# EAGLE schematic kugarem (EAGLE 7.6.0)
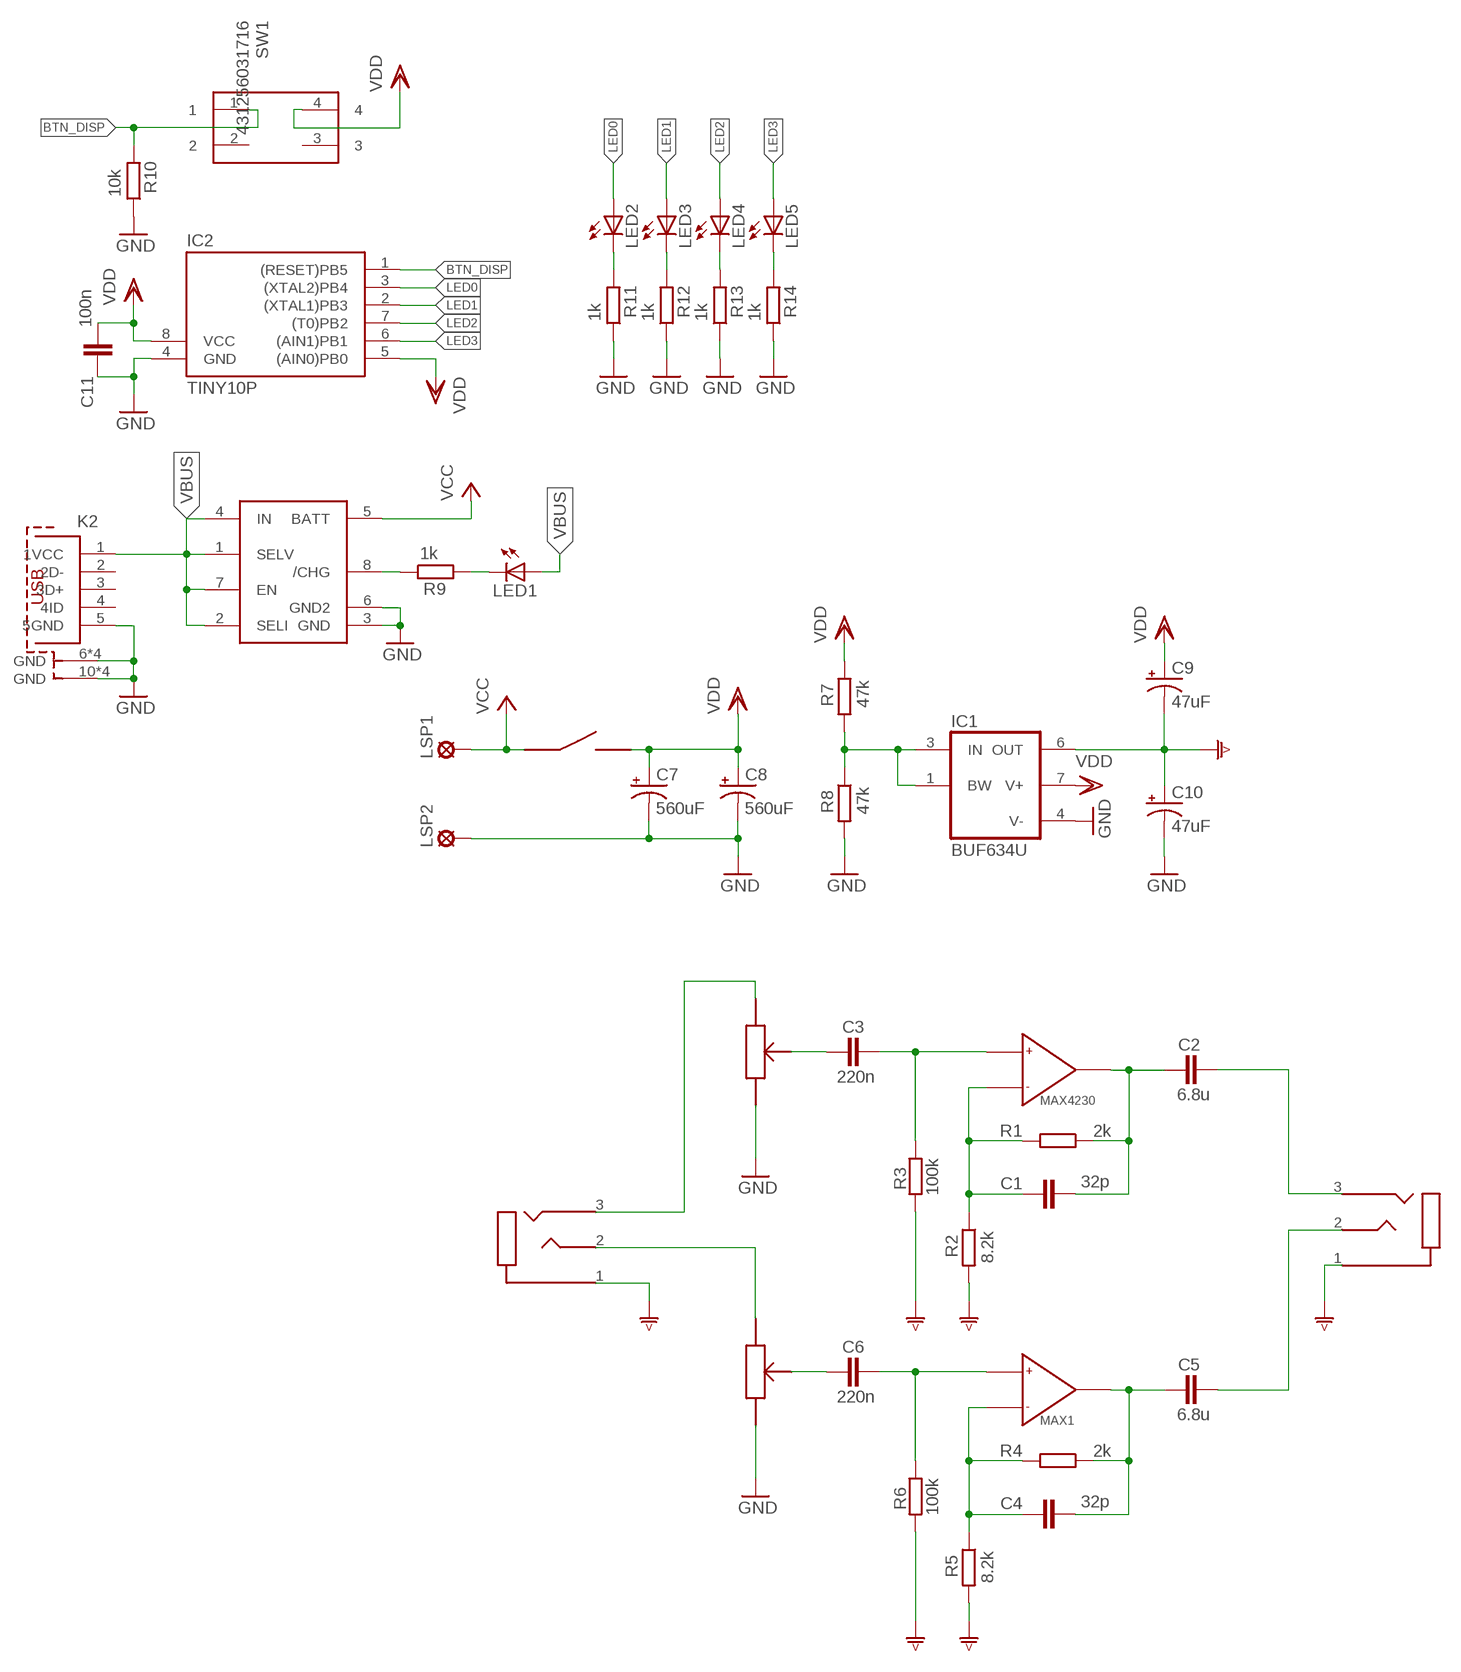
[diagram p0: schematic, sheet 1]

## Parts
C1  32p  C-EUC1206  [C1206]
C2  6.8u  C-EUC1206  [C1206]
C3  220n  C-EUC1206  [C1206]
C4  32p  C-EUC1206  [C1206]
C5  6.8u  C-EUC1206  [C1206]
C6  220n  C-EUC1206  [C1206]
C7  560uF  560UF-PANASONIC_G-25V-20%  [PANASONIC_G]
C8  560uF  560UF-PANASONIC_G-25V-20%  [PANASONIC_G]
C9  47uF  47UF-POLAR-PANASONIC_D-35V-20%  [PANASONIC_D]
C10  47uF  47UF-POLAR-PANASONIC_D-35V-20%  [PANASONIC_D]
C11  100n  C-EUC1206  [C1206]
IC1  BUF634U  [SO08]
IC2  TINY10P  [DIL08]
K2  629105150921  [629105150921]
LED1  LEDCHIPLED_1206  [CHIPLED_1206]
LED2  LEDCHIPLED_1206  [CHIPLED_1206]
LED3  LEDCHIPLED_1206  [CHIPLED_1206]
LED4  LEDCHIPLED_1206  [CHIPLED_1206]
LED5  LEDCHIPLED_1206  [CHIPLED_1206]
LSP1  LSP10  [LSP10]
LSP2  LSP10  [LSP10]
MAX1  MAX4230  [SOT23-5L]
MAX4230  MAX4230  [SOT23-5L]
R1  2k  R-EU_R1206  [R1206]
R2  8.2k  R-EU_R1206  [R1206]
R3  100k  R-EU_R1206  [R1206]
R4  2k  R-EU_R1206  [R1206]
R5  8.2k  R-EU_R1206  [R1206]
R6  100k  R-EU_R1206  [R1206]
R7  47k  R-EU_R1206  [R1206]
R8  47k  R-EU_R1206  [R1206]
R9  1k  R-EU_R1206  [R1206]
R10  10k  R-EU_R1206  [R1206]
R11  1k  R-EU_R1206  [R1206]
R12  1k  R-EU_R1206  [R1206]
R13  1k  R-EU_R1206  [R1206]
R14  1k  R-EU_R1206  [R1206]
SW1  431256031716  [431256031716]
U$1  100k  PTR90  [PTR902]
U$2  SJ1-3515-SMT-TR  [STX-35332-3N-TR]
U$3  SJ1-3515-SMT-TR  [STX-35332-3N-TR]
U$4  MAX1811SO8  [SO08]

## Nets
BTN_DISP: IC2.1((RESET)PB5) R10.2 SW1.1
GND: C7.- C8.- C10.- C11.1 IC1.4(V-) IC2.4(GND) K2.5(5GND) K2.6(GND) K2.7(GND) K2.8(GND) K2.9(GND) K2.10(GND) K2.11(GND) K2.12(GND) K2.13(GND) LSP2.MP R8.2 R10.1 R11.1 R12.1 R13.1 R14.1 U$1.R13 U$1.R23 U$4.3(GND) U$4.6(GND2)
LED0: IC2.3((XTAL2)PB4) LED2.A
LED1: IC2.2((XTAL1)PB3) LED3.A
LED2: IC2.7((T0)PB2) LED4.A
LED3: IC2.6((AIN1)PB1) LED5.A
N$1: C1.2 C2.1 MAX4230.4(OUT) R1.1
N$2: C1.1 MAX4230.3(IN-) R1.2 R2.1
N$3: C2.2 U$3.3(RING)
N$4: C3.2 MAX4230.1(IN+) R3.1
N$5: C4.2 C5.1 MAX1.4(OUT) R4.1
N$6: C4.1 MAX1.3(IN-) R4.2 R5.1
N$7: C3.1 U$1.R22
N$8: C6.2 MAX1.1(IN+) R6.1
N$9: C5.2 U$3.2(TIP)
N$10: C6.1 U$1.R12
N$11: U$1.R21 U$2.3(RING)
N$12: U$1.R11 U$2.2(TIP)
N$13: LED2.C R11.2
N$14: LED3.C R12.2
N$15: LED1.C R9.2
N$16: R9.1 U$4.8(/CHG)
N$17: IC1.1(BW) IC1.3(IN) R7.2 R8.1
N$18: LED4.C R13.2
N$19: LED5.C R14.2
VBUS: K2.1(1VCC) LED1.A U$4.1(SELV) U$4.2(SELI) U$4.4(IN) U$4.7(EN)
VCC: LSP1.MP U$1.SW1 U$4.5(BATT)
VDD: C7.+ C8.+ C9.+ C11.2 IC1.7(V+) IC2.5((AIN0)PB0) IC2.8(VCC) R7.1 SW1.4 U$1.SW2
VGND: C9.- C10.+ IC1.6(OUT) R2.2 R3.2 R5.2 R6.2 U$2.1(SLEEVE) U$3.1(SLEEVE)
Unconnected: K2.2(2D-) K2.3(3D+) K2.4(4ID) MAX1.2(N) MAX1.5(P) MAX4230.2(N) MAX4230.5(P) SW1.2 SW1.3

## Library data of the parts
C1-C6 C11 = rcl:C-EU: CAPACITOR, European symbol
C7 C8 = SparkFun-Capacitors:560UF: 560µF polarized capacitors A capacitor is a passive two-terminal electrical component used to store electrical energy temporarily in an electric field.; PROD_ID: CAP-09983
C9 C10 = SparkFun-Capacitors:47UF-POLAR: 47µF polarized capacitors A capacitor is a passive two-terminal electrical component used to store electrical energy temporarily in an electric field.; PROD_ID: CAP-08478
IC1 = burr-brown:BUF634: 250mA High-Speed Buffer; MF: TEXAS INSTRUMENTS; MPN: BUF634U; OC_FARNELL: 4733617; OC_NEWARK: 27C6567
IC2 = atmel:TINY10: MICROCONTROLLER 1 Kbytes ROM; OC_FARNELL: unknown; OC_NEWARK: unknown
K2 = Input-Output_Connectors_rev15d:629105150921: WR-COM_USB_Micro Type AB_Horizontal_SMT ; Micro Type AB Horizontal SMT - with Pegs - T&R Packaging Code : Con_I-O_COM_USB_2.0_AB_629105150921_629105150921 <http://katalog.we-online.de/media/images/eican/Con_I-O_COM_USB_2.0_AB_629105150921_pf2.jpg> Details see: http://katalog.we-online.de/em/datasheet/629105150921.pdf Created 12/08/2014, Dan Xu 2014 (C) Wurth Elektronik
LED1-LED5 = led:LED: LED OSRAM: - CHIPLED LG R971, LG N971, LY N971, LG Q971, LY Q971, LO R971, LY R971 LH N974, LH R974 LS Q976, LO Q976, LY Q976 LO Q996 - Hyper CHIPLED LW Q18S LB Q993, LB Q99A, LB R99A - SideLED LS A670, LO A670, LY A670, LG A670, LP A670 LB A673, LV A673, LT A673, LW A673 LH A674 LY A675 LS A676, LA A676, LO A676, LY A676, LW A676 LS A679, LY A679, LG A679 - Hyper Micro SIDELED® LS Y876, LA Y876, LO Y876, LY Y876 LT Y87S - SmartLED LW L88C, LW L88S LB L89C, LB L89S, LG L890 LS L89K, LO L89K, LY L89K LS L896, LA L896, LO L896, LY L896 - TOPLED LS T670, LO T670, LY T670, LG T670, LP T670 LSG T670, LSP T670, LSY T670, LOP T670, LYG T670 LG T671, LOG T671, LSG T671 LB T673, LV T673, LT T673, LW T673 LH T674 LS T676, LA T676, LO T676, LY T676, LB T676, LH T676, LSB T676, LW T676 LB T67C, LV T67C, LT T67C, LS T67K, LO T67K, LY T67K, LW E67C LS E67B, LA E67B, LO E67B, LY E67B, LB E67C, LV E67C, LT E67C LW T67C LS T679, LY T679, LG T679 LS T770, LO T770, LY T770, LG T770, LP T770 LB T773, LV T773, LT T773, LW T773 LH T774 LS E675, LA E675, LY E675, LS T675 LS T776, LA T776, LO T776, LY T776, LB T776 LHGB T686 LT T68C, LB T68C - Hyper Mini TOPLED® LB M676 - Mini TOPLED Santana® LG M470 LS M47K, LO M47K, LY M47K Source: http://www.osram.convergy.de LUXEON: - LUMILED® LXK2-PW12-R00, LXK2-PW12-S00, LXK2-PW14-U00, LXK2-PW14-V00 LXK2-PM12-R00, LXK2-PM12-S00, LXK2-PM14-U00 LXK2-PE12-Q00, LXK2-PE12-R00, LXK2-PE12-S00, LXK2-PE14-T00, LXK2-PE14-U00 LXK2-PB12-K00, LXK2-PB12-L00, LXK2-PB12-M00, LXK2-PB14-N00, LXK2-PB14-P00, LXK2-PB14-Q00 LXK2-PR12-L00, LXK2-PR12-M00, LXK2-PR14-Q00, LXK2-PR14-R00 LXK2-PD12-Q00, LXK2-PD12-R00, LXK2-PD12-S00 LXK2-PH12-R00, LXK2-PH12-S00 LXK2-PL12-P00, LXK2-PL12-Q00, LXK2-PL12-R00 Source: www.luxeon.com KINGBRIGHT: KA-3528ASYC Source: www.kingbright.com
LSP1 LSP2 = solpad:LSP10: SOLDER PAD drill 1.0 mm, distributor Buerklin, 12H555
MAX1 MAX4230 = kugarem-lib:MAX4230
R1-R14 = rcl:R-EU_: RESISTOR, European symbol
SW1 = Switches_rev16a:431256031716: WS-TST, 6*6mm right angle Tact switch,THT, height 3.15mm, 4 pins, black actuator, 160gf
U$1 = Kuga2_parts:PTR90
U$2 U$3 = Kuga2_parts:SJ1-3515-SMT-TR
U$4 = adafruit:MAX1811: Maxim MAX1811 USB li-ion battery charger http://www.ladyada.net/library/eagle